# EAGLE design breakout-DLIPM4 (EAGLE 9.1.0)
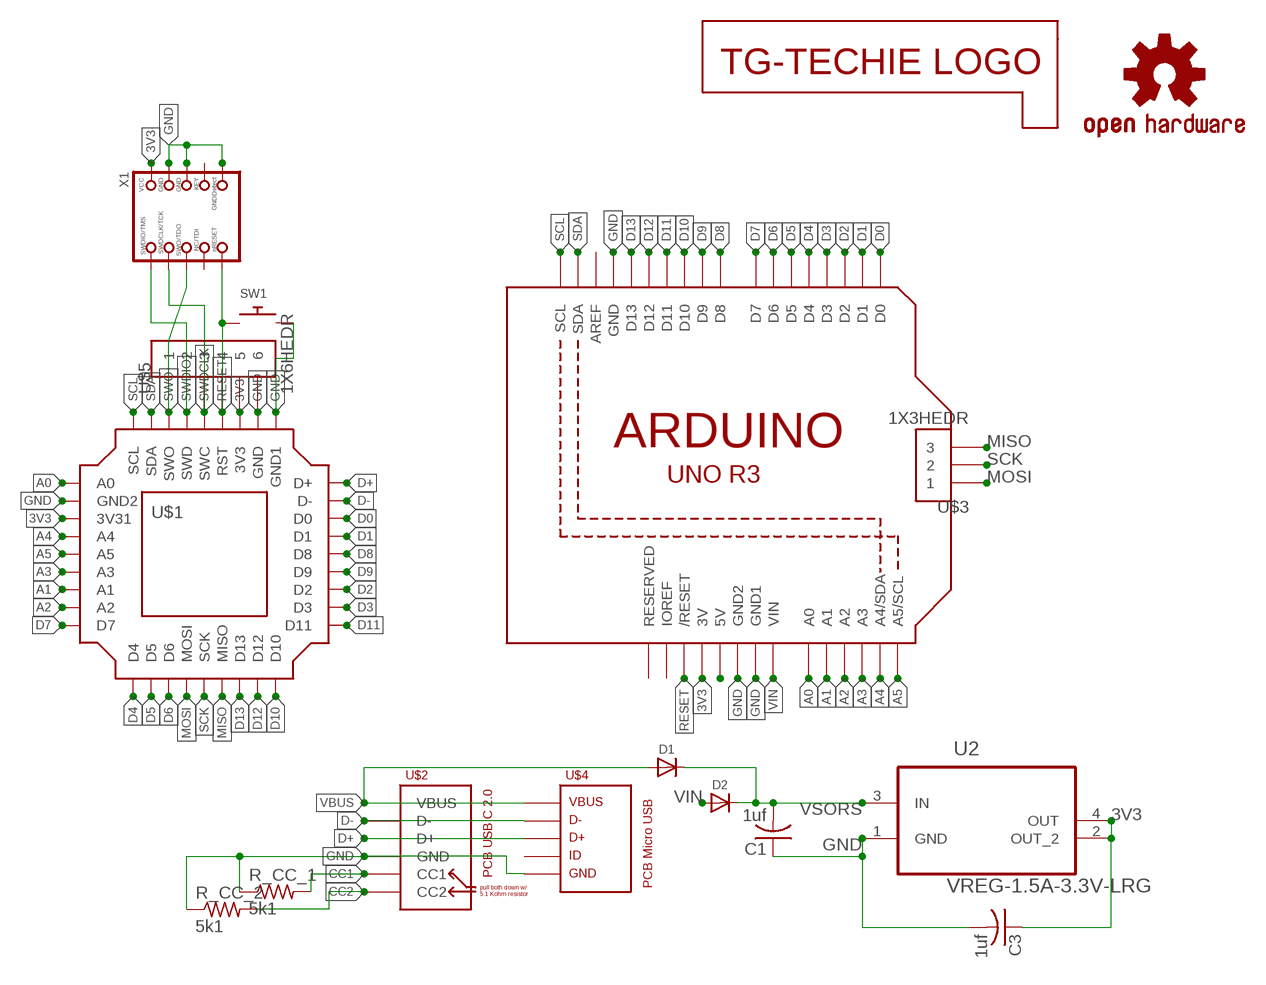
[diagram p0: schematic, sheet 1]

## Parts
C1  1uf  C-TG  [TG-C0805MP]
C3  1uf  C-TG  [TG-C0805MP]
D1  DIODESOD-123  [SOD-123]
D2  DIODESOD-123  [SOD-123]
LOGO1  OSHW-LOGOS  [OSHW-LOGO-S]
R_CC_1  5k1  R_TG  [TG-R0805]
R_CC_2  5k1  R_TG  [TG-R0805]
SW1  SWITCH_PUSHBUTTONEVQ-PE  [TACT_PANA-EVQ]
U1  ARDUINOR3-DIMENSION  [ARDUINOR3]
U2  VREG-1.5A-3.3V-LRG  [SOT230P700X180-4N]
U$1  DATALORE-IP-M4  [DL_IP_36-.1IN-FOOTPRINT]
U$2  USB-C-PCB-USB-2.0-TYPE-CDS_2  [USB_TYPE_C_DS_2]
U$3  1X3HEDR  [1X3_HEDR]
U$4  USB-B-PCB-MICRO_BSS_2  [USB_TYPE_B_SS_2]
U$5  1X6HEDR  [1X6_HEDR]
U$7  LOGO-TG_TECHIEBIG?  [LOGO_TG_TEST_LARGE]
X1  CON-SWD-JTAG-CORTEXBOXPOSTS  [2X05_1.27MM_BOX_POSTS]

## Nets
3V3: C3.1 U1.3V U2.2(OUT_2) U2.4(OUT) U$1.7(3V3) U$1.34(3V31) U$5.5 X1.1(VCC)
A0: U1.A0 U$1.36(A0)
A1: U1.A1 U$1.30(A1)
A2: U1.A2 U$1.29(A2)
A3: U1.A3 U$1.31(A3)
A4: U1.A4(A4/SDA) U$1.33(A4)
A5: U1.A5(A5/SCL) U$1.32(A5)
CC1: R_CC_1.2 U$2.A5(CC1)
CC2: R_CC_2.2 U$2.B5(CC2)
D0: U1.D0 U$1.12(D0)
D1: U1.D1 U$1.13(D1)
D2: U1.D2 U$1.16(D2)
D3: U1.D3 U$1.17(D3)
D4: U1.D4 U$1.27(D4)
D5: U1.D5 U$1.26(D5)
D6: U1.D6 U$1.25(D6)
D7: U1.D7 U$1.28(D7)
D8: U1.D8 U$1.14(D8)
D9: U1.D9 U$1.15(D9)
D10: U1.D10 U$1.19(D10)
D11: U1.D11 U$1.18(D11)
D12: U1.D12 U$1.20(D12)
D13: U1.D13 U$1.21(D13)
D+: U$1.10(D+) U$2.A6(D+) U$2.B6(D+) U$4.3
D-: U$1.11(D-) U$2.A7(D-) U$2.B7(D-) U$4.2
GND: C1.1 C3.2 R_CC_1.1 R_CC_2.1 SW1.P$2 U1.GND U1.GND1 U1.GND2 U2.1(GND) U$1.8(GND) U$1.9(GND1) U$1.35(GND2) U$2.A1(GND) U$2.A12(GND) U$2.B1(GND) U$2.B12(GND) U$4.5 U$5.6 X1.3(GND) X1.5(GND) X1.9(GNDDETECT)
MISO: U$1.22(MISO) U$3.3
MOSI: U$1.24(MOSI) U$3.1
N$27: U1.5V
RESET: SW1.P$1 U1.RESET(/RESET) U$1.6(RST) U$5.4 X1.10(NRESET)
SCK: U$1.23(SCK) U$3.2
SCL: U1.SCL U$1.1(SCL)
SDA: U1.SDA U$1.2(SDA)
SWDCLK: U$1.5(SWC) U$5.3 X1.4(SWDCLK)
SWDIO: U$1.4(SWD) U$5.2 X1.2(SWDIO)
SWO: U$1.3(SWO) U$5.1 X1.6(SWO)
VBUS: D1.A U$2.A4(VBUS) U$2.A9(VBUS) U$2.B4(VBUS) U$2.B9(VBUS) U$4.1
VIN: D2.A U1.VIN
VSORS: C1.2 D1.C D2.C U2.3(IN)
Unconnected: U1.AREF U1.IOREF U1.RESERVED U$4.4 X1.7(KEY) X1.8(TDI)

## Library data of the parts
C1 C3 = 0TG-Lib v01.4:C-TG
D1 D2 = 0TG-Lib v01.4:DIODE: Diode from: adafruit SMA Model Volts Amps Type Vf Ir Digikey # Notes SSA34-E3 40V 3A Schottky 480mV @ 3A 200uA @ 40V SSA34-E3/61TGITR-ND CDBA120-G 20V 1A Schottky 500mV @ 1A 500uA @ 20V 641-1014-6-ND REEL MBRA210 10V 2A Schottky 350mV @ 2A 700uA @ 10V MBRA210LT3 SOD-123 Model Volts Amps Type Vf Ir Order # Notes BAT54T1G 30V 200mA Schottky 800mV @ 200mA 2uA @ 25V BAT54T1GOSTR-ND B0530W 30V 500mA Schottky 430mV @ 500mA 130uA @ 30V B0530W-FDICT-ND REEL MBR120 20V 1A Schottky 340mV @ 1A MBR120VLSFT1GOSCT-ND SOD-323 Model Volts Amps Type Vf Ir Order # Notes PMEG2005EJ 20V 500mA Schottky 355mV @ 500mA 568-4110-1-ND ZLLS410 10V 570mA Schottky 380mV @ 570mA ZLLS410CT-ND 1N4148WS 75V 150mA Silicon/Simple 1V 1N4148WSFSCT-ND REEL SOD-523 Model Volts Amps Type Vf Ir Order # Notes BAT54XV2 30V 200mA Schottky 0.8V @ 100mA BAT54XV2CT-ND TB751S 30V 30mA Schottky RB751S-40TE61CT-ND SOT23-R/W (R = Solder Paste/Reflow Ovens, W = Hand-Soldering) Model Volts Amps Type Vf Ir Order # Notes BAT54FILM 40V 300mA Schottky 497-7162-1-ND POWERDI-5 Model Volts Amps Type Vf Ir Order # Notes PDS560 60V 5A Schottky 670mV @ 5A 150uA @ 60V PDS560DICT-ND
LOGO1 = SparkFun-Aesthetics:OSHW-LOGO: Open-Source Hardware (OSHW) Logo This logo indicates the piece of hardware it is found on incorporates a OSHW license and/or adheres to the definition of open source hardware found here: http://freedomdefined.org/OSHW
R_CC_1 R_CC_2 = 0TG-Lib v01.4:R_TG
SW1 = 00adafruit:SWITCH_PUSHBUTTON: Buttons SOFTTOUCHSMD_SJ - Soft touch temporary push button (Super Junk Akihabara) Compatible with SKPMANE010 [Mouser: 688-SKPMAN] C&K_KSS = Digikey: KSS221GLFS
U1 = 00adafruit:ARDUINOR3: This is a new object for the new Arduino R3 - with extra pins that you may want to use (such as IOref, and duplicated A4/A5
U2 = 0TG-Lib v01.4:VREG-1.5A-3.3V-LRG: from: snapeda Low Dropout Regulator works with: TLV1117LV33DCYR ADP3339AKCZ-3.3-RL (older ++$); AVAILABILITY: Good; DESCRIPTION: IC REG LINEAR 3.3V 1.5A SOT223-3; MF: Analog Devices; MP: ADP3339AKCZ-3.3-RL; PACKAGE: SOT-223-3 Analog Devices; PRICE: 3.52 USD
U$1 = 0TG-Lib v01.4:DATALORE-IP-M4
U$2 = 0TG-Lib v01.4:USB-C-PCB-USB-2.0-TYPE-C: from: Pinuct on github, modified by: TG-Techie
U$3 = 0TG-Lib v01.4:1X3
U$4 = 0TG-Lib v01.4:USB-B-PCB-MICRO_B: from: Pinuct on github, modified by: TG-Techie
U$5 = 0TG-Lib v01.4:1X6
U$7 = 0TG-Lib v01.4:LOGO-TG_TECHIE
X1 = 0TG-Lib v01.4:CON-SWD-JTAG-CORTEX: from: adafruit Serial Wire (SW-DP) Connector Standard 0.05" 10-pin connector is for use with the Cortex M and Cortex A SWD (serial wire debugger) interface (SW-DP) Connectors 2x05_1.27MM_SMT - Inexpensive surface-mount header with bare pins, compatible with standard 10-pin SWD cables (4UCON: 16846) 2x05_1.27MM_BOX_NOPOSTS - Polarised surface-mount box (4UCON with caps: 19735, without caps: 15117 2x05_1.27MM_BOX_POSTS - Polarised surface-mount box with mounting holes (4UCON: 20317) Pinout: http://infocenter.arm.com/help/topic/com.arm.doc.faqs/attached/13634/cortex_debug_connectors.pdf http://www.keil.com/peripherals/coresight/connectors.asp

## Board
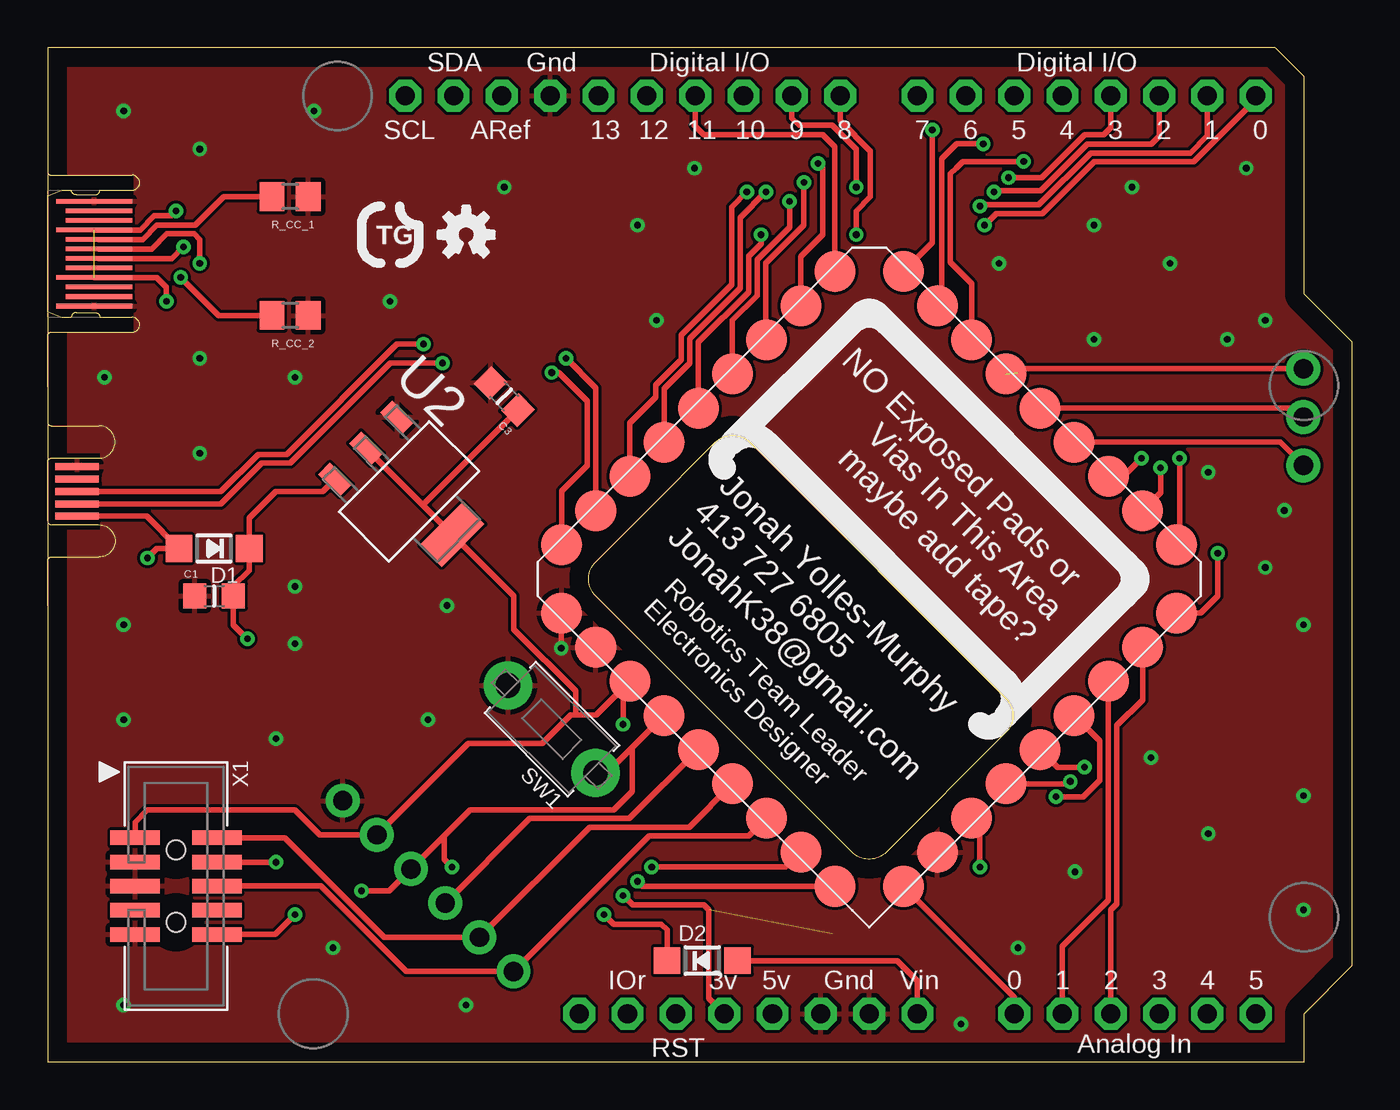
[diagram p1: board, top side]
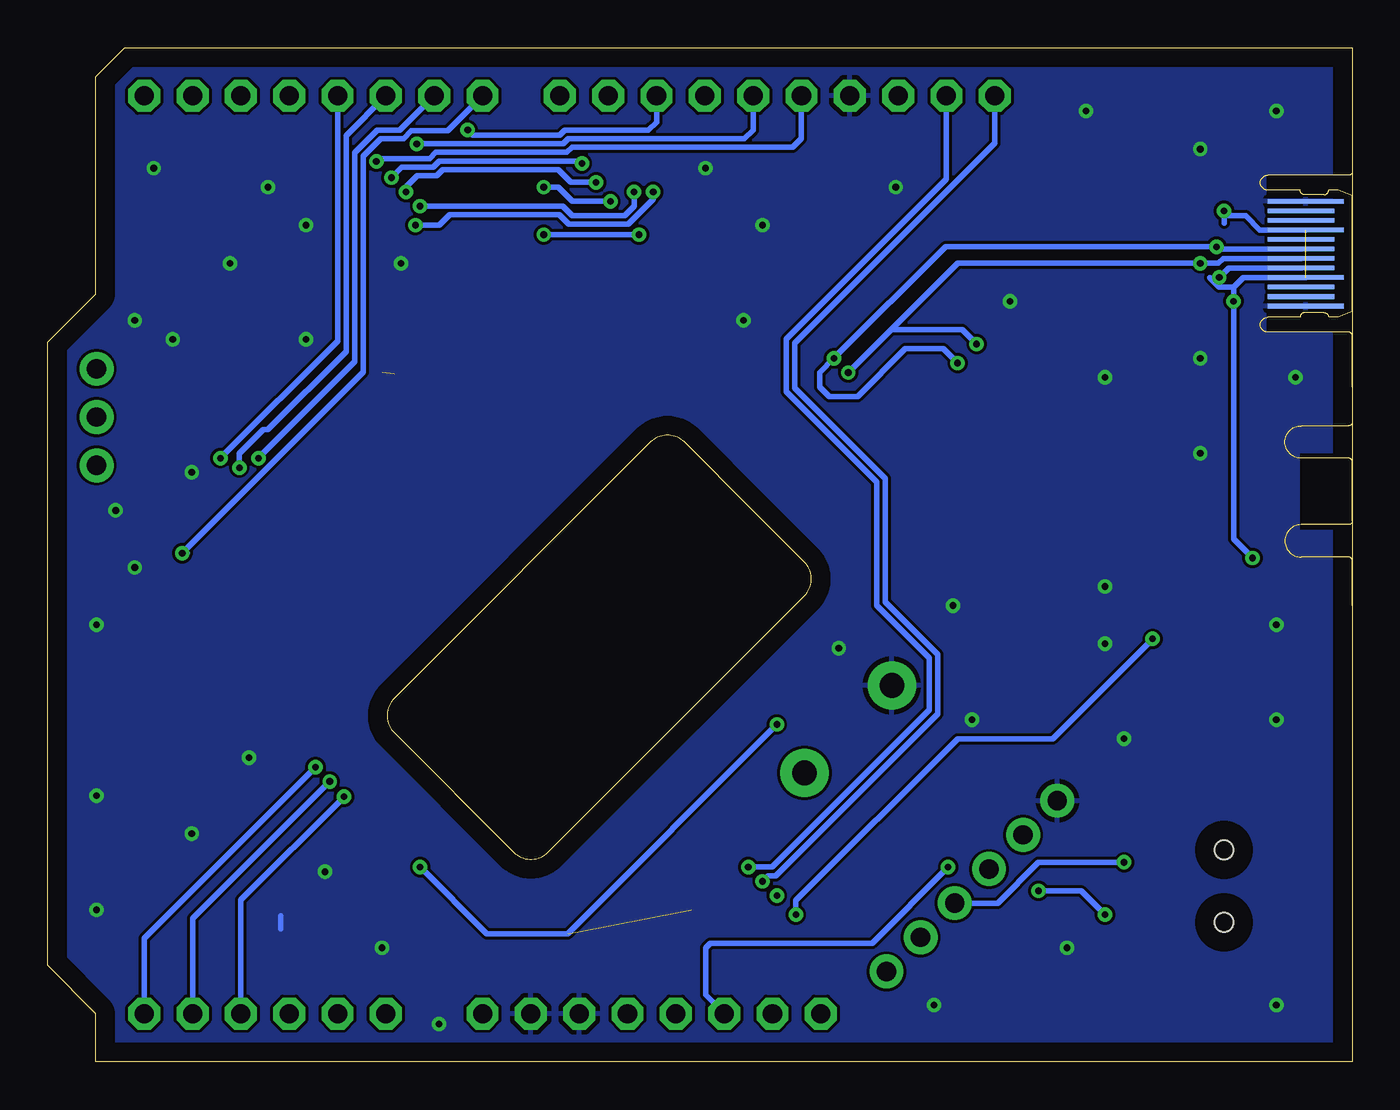
[diagram p2: board, bottom side, seen from below]

Size 68.58 x 53.34 mm. Coordinates in mm from the lower left corner, seen from the top.
Copper layers (1*16): Top 0.035mm / dielectric 1.5mm / Bottom 0.035mm
Design rules "default *": minimum track width 0.3mm, minimum drill 0.35mm, track to track 6mil, track to pad 6mil, pad to pad 6mil, via to via 6mil, smd to smd 6mil, copper to edge 40mil, drill to drill 6mil, minimum pad ring 10mil, minimum via ring 8mil, stop-mask expansion 4mil, vias tented up to drill 0mil, thermal gap 10mil

### Footprints (pad centres in the part's own frame; a part is rotated, then mirrored left to right if it is on the bottom)
TG-C0805MP = smd 1.2 x 1.3: 1 -1.016,0; 2 1.016,0
SOD-123 = smd 1.4 x 1.4: A 1.85,0; C -1.85,0
TG-R0805 = smd 1.3 x 1.5: 1 -0.95,0; 2 0.95,0
TACT_PANA-EVQ = drill 1.3 pad 2.54: P$1 -3.25,0; P$2 3.25,0
ARDUINOR3 = drill 1 pad 1.676 octagon: 3V 35.56,2.54; 5V 38.1,2.54; A0 50.8,2.54; A1 53.34,2.54; A2 55.88,2.54; A3 58.42,2.54; A4 60.96,2.54; A5 63.5,2.54; AREF 23.876,50.8; D0 63.5,50.8; D1 60.96,50.8; D2 58.42,50.8; D3 55.88,50.8; D4 53.34,50.8; D5 50.8,50.8; D6 48.26,50.8; D7 45.72,50.8; D8 41.656,50.8; D9 39.116,50.8; D10 36.576,50.8; D11 34.036,50.8; D12 31.496,50.8; D13 28.956,50.8; GND 26.416,50.8; GND1 43.18,2.54; GND2 40.64,2.54; IOREF 30.48,2.54; RESERVED 27.94,2.54; RESET 33.02,2.54; SCL 18.796,50.8; SDA 21.336,50.8; VIN 45.72,2.54
SOT230P700X180-4N = smd 1.626 x 0.889: 1 -3.2,2.311; 2 -3.2,0; 3 -3.2,-2.311 | smd 1.626 x 3.175: 4 3.2,0
DL_IP_36-.1IN-FOOTPRINT = smd 2.159 x 2.159: 1 -10.16,12.7; 2 -7.62,12.7; 3 -5.08,12.7; 4 -2.54,12.7; 5 0,12.7; 6 2.54,12.7; 7 5.08,12.7; 8 7.62,12.7; 9 10.16,12.7; 10 12.7,10.16; 11 12.7,7.62; 12 12.7,5.08; 13 12.7,2.54; 14 12.7,0; 15 12.7,-2.54; 16 12.7,-5.08; 17 12.7,-7.62; 18 12.7,-10.16; 19 10.16,-12.7; 20 7.62,-12.7; 21 5.08,-12.7; 22 2.54,-12.7; 23 0,-12.7; 24 -2.54,-12.7; 25 -5.08,-12.7; 26 -7.62,-12.7; 27 -10.16,-12.7; 28 -12.7,-10.16; 29 -12.7,-7.62; 30 -12.7,-5.08; 31 -12.7,-2.54; 32 -12.7,0; 33 -12.7,2.54; 34 -12.7,5.08; 35 -12.7,7.62; 36 -12.7,10.16
USB_TYPE_C_DS_2 = smd 0.25 x 4: A1 2.75,-2.45; A4 1.25,-2.45; A9 -1.25,-2.45; A12 -2.75,-2.45 | smd 0.25 x 3.5: A2 2.25,-2.7; A3 1.75,-2.7; A5 0.75,-2.7; A6 0.25,-2.7; A7 -0.25,-2.7; A8 -0.75,-2.7; A10 -1.75,-2.7; A11 -2.25,-2.7 | smd 0.25 x 4 bottom: B1 -2.75,-2.45; B4 -1.25,-2.45; B9 1.25,-2.45; B12 2.75,-2.45 | smd 0.25 x 3.5 bottom: B2 -2.25,-2.7; B3 -1.75,-2.7; B5 -0.75,-2.7; B6 -0.25,-2.7; B7 0.25,-2.7; B8 0.75,-2.7; B10 1.75,-2.7; B11 2.25,-2.7
1X3_HEDR = drill 1.016 pad 1.778: 1 -2.54,0; 2 0,0; 3 2.54,0
USB_TYPE_B_SS_2 = smd 0.37 x 2.3: 1 -1.3,-1.55; 2 -0.65,-1.55; 3 0,-1.55; 4 0.65,-1.55; 5 1.3,-1.55
1X6_HEDR = drill 1.016 pad 1.778: 1 -6.35,0; 2 -3.81,0; 3 -1.27,0; 4 1.27,0; 5 3.81,0; 6 6.35,0
2X05_1.27MM_BOX_POSTS = smd 0.76 x 2.6: 1 -2.54,-2.15; 2 -2.54,2.15; 3 -1.27,-2.15; 4 -1.27,2.15; 5 0,-2.15; 6 0,2.15; 7 1.27,-2.15; 8 1.27,2.15; 9 2.54,-2.15; 10 2.54,2.15 | hole 1: -1.905,0; 1.905,0

### Placement (x,y rotation side)
C1  8.75,24.5 0 top
C3  24,35 135 top
D1  8.75,27 180 top
D2  34.41,5.33 0 top
LOGO1  22,43.5 0 top
R_CC_1  12.75,45.5 180 top
R_CC_2  12.75,39.25 180 top
SW1  26.5,17.5 135 top
U1  0,0 0 top
U2  19,30 315 top
U$1  43.18,25.4 135 top
U$2  0,42.5 90 top
U$3  66,33.91 90 top
U$4  0,30 90 top
U$5  20,9.25 135 top
U$7  18,42 0 top
X1  6.75,9.25 270 top

### Tracks (layer width: path | path; a pad name or v marks a point on that pad's centre or on a via)
3V3  (via drill 0.35)  (1 unrouted)
  Top 0.3: 27.75,18.25 28.85,18.25 U$1.7 30.25,19.65 v30.25,17.75 | 27.75,18.25 27.5,18.25 26,16.75 22.11,16.75 U$5.5 14.31,11.94 13,13.25 5.25,13.25 4.6,12.6 X1.1 | U1.3V 34.75,3.35 34.75,8 34.5,8.25 30.75,8.25 v30.25,8.75 | v49,10.25 49,12.4 U$1.34 | U2.2 19.75,29.25 | 19.75,29.25 U2.4 24.5,24.5 24.5,22.75 27.75,19.5 27.75,18.25 | C3.1 19.75,29.31 19.75,29.25
  Bottom 0.3: v30.25,17.75 41.25,6.75 45.5,6.75 v49,10.25
A0
  Top 0.3: U$1.36 50.8,3.41 U1.A0
A1
  Top 0.3: U$1.30 55.75,8.5 53.34,6.09 U1.A1
A2
  Top 0.3: U1.A2 55.88,7.99 56.2,8.31 56.2,17.7 57.55,19.05 U$1.29
A3  (via drill 0.35)
  Top 0.3: U$1.31 55.3,16.87 55.3,14.8 54.44,13.94 v53,13.94
  Bottom 0.3: v53,13.94 58.42,8.52 U1.A3
A4  (via drill 0.35)
  Top 0.3: U$1.33 53.62,14.62 v53.75,14.75
  Bottom 0.3: v53.75,14.75 60.96,7.54 U1.A4
A5  (via drill 0.35)
  Top 0.3: U$1.32 53.08,15.5 v54.5,15.5
  Bottom 0.3: U1.A5 63.5,6.5 v54.5,15.5
CC1
  Top 0.3: U$2.A5 5,43.25 5.75,44 7.75,44 9.25,45.5 R_CC_1.2
CC2  (via drill 0.35)
  Top 0.3: v7,41.25 9,39.25 R_CC_2.2
  Bottom 0.3: U$2.B5 6.5,41.75 v7,41.25
D0  (via drill 0.35)
  Top 0.3: U1.D0 63.5,50.61 60.23,47.34 55.02,47.34 52.29,44.62 49.87,44.62 v49.25,44 | v36.75,45.75 35.95,44.95 35.95,40.87 33.3,38.21 33.3,36.94 31.95,35.59 31.95,34.95 30.61,33.61 U$1.12
  Bottom 0.3: v49.25,44 48,44 47.45,44.55 41.69,44.55 41.19,44.05 38.06,44.05 36.75,45.36 v36.75,45.75
D1  (via drill 0.35)
  Top 0.3: U1.D1 60.96,48.71 60.05,47.8 54.83,47.8 52.1,45.07 49.07,45.07 v49,45 | v37.75,45.75 36.4,44.4 36.4,40.68 33.75,38.03 33.75,36.75 32.4,35.4 U$1.13
  Bottom 0.3: v49,45 41.5,45 41,44.5 38.25,44.5 37.75,45 v37.75,45.75
D2  (via drill 0.35)
  Top 0.3: U1.D2 58.42,48.67 58,48.25 54.64,48.25 52.21,45.82 49.82,45.82 v49.75,45.75 49.8,45.8 | 37.75,38.01 37.76,38.01 | 37.76,38.01 U$1.16 | v39.75,46.25 39.75,44 37.76,42.01 37.76,38.01
  Bottom 0.3: v39.75,46.25 41.08,46.25 41.75,46.92 47.8,46.92 48.12,46.59 49.16,46.59 49.75,46 v49.75,45.75
D3  (via drill 0.35)
  Top 0.3: U1.D3 55.88,49.13 55.5,48.75 54.5,48.75 52.25,46.5 v50.5,46.5 | 39.5,39.86 U$1.17 39.59,42.34 40.75,43.5 40.75,47 v40.5,47.25
  Bottom 0.3: v50.5,46.5 49.95,47.05 48.31,47.05 47.99,47.38 40.62,47.38 v40.5,47.25
D4  (via drill 0.35)
  Top 0.3: U$1.27 59.5,27.35 v59.5,31.75
  Bottom 0.3: v59.5,31.75 53.34,37.91 U1.D4
D5  (via drill 0.35)
  Top 0.3: U$1.26 58.5,29.94 v58.5,31.25
  Bottom 0.3: U1.D5 52.89,48.71 52.89,37.36 57,33.25 57.25,33.25 58.5,32 v58.5,31.25
D6  (via drill 0.35)
  Top 0.3: U$1.25 56.54,30.79 v57.5,31.75
  Bottom 0.3: v57.5,31.75 52.44,36.81 52.44,47.81 51.25,49 50.06,49 U1.D6
D7  (via drill 0.35)
  Top 0.3: U$1.28 60.6,23.6 61.5,24.5 v61.5,26.75
  Bottom 0.3: 61.25,26.75 v61.5,26.75 51.98,36.27 51.98,47.63 51.06,48.55 49.87,48.55 49.46,48.96 47.56,48.96 U1.D7
D8  (via drill 0.35)
  Top 0.3: U$1.14 34.2,37.84 36.85,40.49 36.85,42.38 37.5,43.03 v37.5,43.5 | v42.5,43.5 42.5,44.75 43.25,45.5 43.25,47.89 41.66,49.48 U1.D8
  Bottom 0.3: v37.5,43.5 v42.5,43.5
D9  (via drill 0.35)
  Top 0.3: U$1.15 36,39 37.3,40.3 37.3,42.19 39,43.89 v39,45.25 | v42.5,46 42.5,48 41.25,49.25 39.5,49.25 39.12,49.63 U1.D9
  Bottom 0.3: v42.5,46 41.75,46 41,45.25 v39,45.25
D10  (via drill 0.35)
  Top 0.3: U$1.19 46.5,43.09 v46.5,49
  Bottom 0.3: U1.D10 36.58,49.42 37,49 41.39,49 41.66,48.73 46.23,48.73 v46.5,49
D11
  Top 0.3: U$1.18 41.38,48.12 40.75,48.75 34.5,48.75 34,49.25 34.04,49.29 U1.D11
D12  (via drill 0.35)
  Top 0.3: U$1.20 47,40 47,47.5 47.78,48.28 v49.18,48.28
  Bottom 0.3: v49.18,48.28 41.47,48.28 41.2,48.55 31.95,48.55 31.5,49 U1.D12
D13  (via drill 0.35)
  Top 0.3: U$1.21 48.57,40.93 47.45,42.05 47.45,46.7 47.75,47 48.09,47.34 v51.3,47.34
  Bottom 0.3: v51.3,47.34 51.15,47.5 48.5,47.5 48.17,47.83 41.28,47.83 41.02,48.09 29.41,48.09 28.96,48.54 U1.D13
D+  (via drill 0.35)
  Top 0.3: U$2.A6 5.46,42.75 6.26,43.55 7.7,43.55 8,43.25 v8,42 | U$1.10 27.02,30.02 28.36,31.36 28.36,34.75 26.86,36.25 v26.5,36.25 | v19.75,37.75 18.36,37.75 12.56,31.95 11.06,31.95 9.11,30 U$4.3
  Bottom 0.3: U$2.B6 6.8,42.25 7.05,42 v8,42 20.75,42 v26.5,36.25 24.25,38.5 20.5,38.5 v19.75,37.75
D-  (via drill 0.35)
  Top 0.3: v7.14,42.87 6.53,42.25 U$2.A7 | 28.76,28.99 U$1.11 28.81,35.44 v27.25,37 | U$4.2 9.1,29.35 11.25,31.5 12.75,31.5 18,36.75 v20.75,36.75
  Bottom 0.3: U$2.B7 7.03,42.75 v7.14,42.87 21.38,42.87 v27.25,37 28,36.25 28,35.5 27.5,35 26,35 23.5,37.5 21.5,37.5 v20.75,36.75
GND  (via drill 0.35)
  Top 0.3: U$1.9 27,23.59 v27,21.75
  Bottom 0.3: 56.32,7.68 56.32,7
  other vias: 4,50 14,50 8,48 24,46 31,44 34,47 32,39 18,40 13,36 8,32 8,37 3,36 4,23 4,18 12,17 13,22 13,25 21,24 20,18 15,6 4,3 22,3 51,6 48,2 54,10 66,8 61,12 58,16 66,14 66,23 64,26 65,29 61,31 55,38 62,38 64,39 59,42 55,44 50,42 57,46 63,47
  pour Top: -1.27,54.61 71.12,54.61 71.12,-2.54 -2.54,-2.54 -2.54,54.61
  pour Bottom: -3.81,55.88 72.39,55.88 72.39,-3.81 -3.81,-3.81
MISO  (1 unrouted)
  Top 0.3: U$3.3 51.2,36.45 51,36.25
MOSI
  Top 0.3: U$3.1 64.79,32.58 U$1.24
RESET  (via drill 0.35)
  Top 0.3: U$1.6 30.72,16.53 | 30.72,16.53 29.39,15.2 SW1.P$1 | 30.72,16.53 30.72,14.22 29.75,13.25 22.2,13.25 20.85,11.9 | 20.85,11.9 U$5.4 17.95,9 v16.5,9 | v13,7.75 11.96,6.71 X1.10 | v21.25,10.25 20.85,10.65 20.85,11.9
  Bottom 0.3: U1.RESET 34,3.52 34,6 33.75,6.25 25.25,6.25 v21.25,10.25 | v16.5,9 14.25,9 v13,7.75
SCK
  Top 0.3: U$3.2 65.53,34.38 U$1.23
SCL  (via drill 0.35)
  Top 0.3: U$1.1 31.26,9.24 v31,9.5
  Bottom 0.3: U1.SCL 18.8,48.31 29.3,37.81 29.3,35.44 24.55,30.69 24.55,25.5 24.55,24.19 21.8,21.44 21.8,18.31 30.31,9.8 30.7,9.8 v31,9.5
SDA  (via drill 0.35)
  Top 0.3: U$1.2 38.81,10.25 v31.75,10.25
  Bottom 0.3: v31.75,10.25 30.5,10.25 22.25,18.5 22.25,21.25 25,24 25,30.5 29.75,35.25 29.75,38 21.34,46.41 U1.SDA
SWDCLK  (via drill 0.35)
  Top 0.3: U$5.3 25.34,12.8 30.58,12.8 U$1.5 | v12,10.5 8.92,10.5 X1.4
  Bottom 0.3: U$5.3 18.65,8.35 16.5,10.5 v12,10.5
SWDIO
  Top 0.3: U$1.4 33.72,12.35 28.48,12.35 U$5.2 17.69,6.56 12.46,11.79 X1.2
SWO
  Top 0.3: U$1.3 36.86,11.89 31.62,11.89 U$5.1 18.85,4.76 14.36,9.25 X1.6
VBUS  (via drill 0.35)  (1 unrouted)
  Top 0.3: U$2.B9 4.86,43.75 5.61,44.5 6.5,44.5 v6.75,44.75 | U$2.B4 5.75,41.25 6.25,40.75 v6.25,40 | U$4.1 5.2,28.7 D1.A 5.75,27 v5.25,26.5
  Bottom 0.3: U$2.B9 4.86,43.75 5.61,44.5 6.5,44.5 v6.75,44.75 6.75,44.1 | U$2.B4 5.75,41.25 6.25,40.75 | 6.25,40.75 7,40.75 7.5,41.25 | 6.25,40.75 v6.25,40 6.25,27.5 v5.25,26.5
VIN
  Top 0.3: D2.A 44.67,5.33 45.72,4.28 U1.VIN
VSORS  (via drill 0.35)
  Top 0.3: U2.3 14.47,30 12,30 10.6,28.6 D1.C 10.6,25.85 9.77,25.02 C1.2 9.77,22.98 v10.5,22.25 | D2.C 32.56,6.94 32.25,7.25 29.75,7.25 v29.25,7.75
  Bottom 0.3: v29.25,7.75 29.25,8.5 20.75,17 15.75,17 v10.5,22.25

### Text on the board
tPlace: Jonah Yolles-Murphy / 413 727 6805 / JonahK38@gmail.com | Robotics Team Leader / Electronics Designer